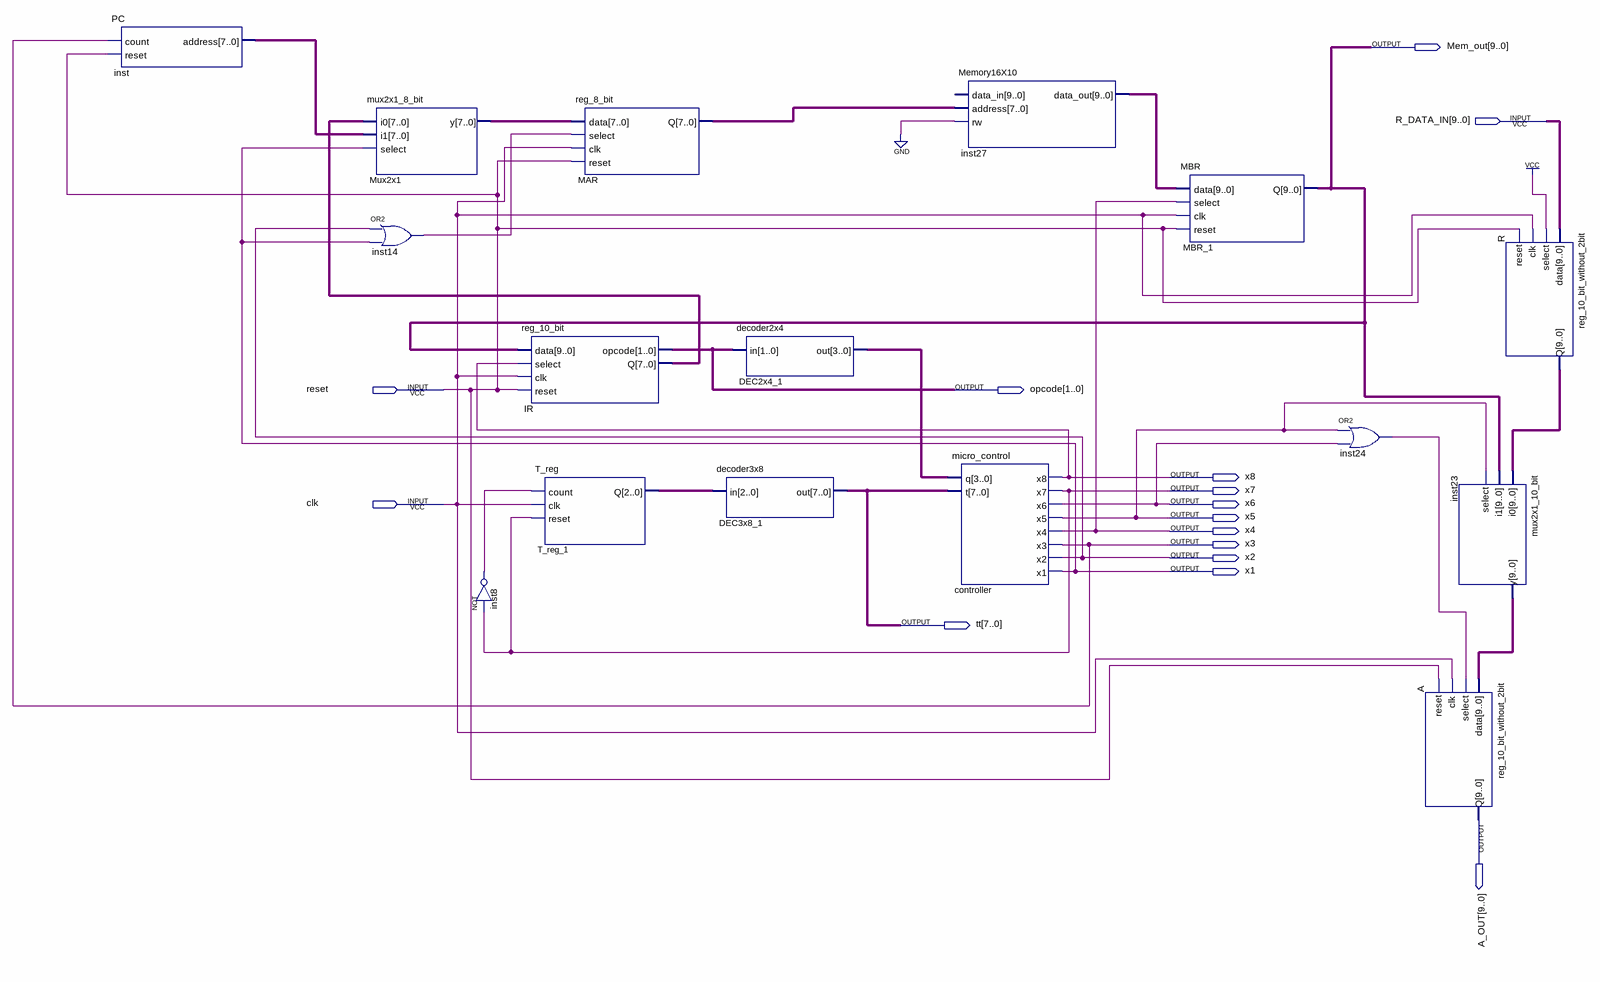
[diagram p0: schematic sheet]
// Quartus schematic orag_v2.bdf as structural Verilog: 16 symbols, 15 pins
module orag_v2 (
  input  [9:0] R_DATA_IN,
  input  reset,
  input  clk,
  output [9:0] Mem_out,
  output [1:0] opcode,
  output x8,
  output x7,
  output x6,
  output x5,
  output x4,
  output x3,
  output x2,
  output x1,
  output [7:0] tt,
  output [9:0] A_OUT
);

  wire inst8_out, inst14_out, inst24_out;
  wire [2:0] T_reg_1_q;
  wire [3:0] DEC2x4_1_out;
  wire [7:0] inst_address, IR_q, MAR_q, Mux2x1_y;
  wire [9:0] inst23_y, inst27_data_out, R_q;

  PC inst (.count(x3), .reset(reset), .address(inst_address));
  mux2x1_8_bit Mux2x1 (.i0(IR_q), .i1(inst_address), .select(x1), .y(Mux2x1_y));
  or inst14 (inst14_out, x2, x1);
  not inst8 (inst8_out, x7);
  reg_10_bit IR (.data(Mem_out), .select(x8), .clk(clk), .reset(reset), .opcode(opcode), .Q(IR_q));
  reg_8_bit MAR (.data(Mux2x1_y), .select(inst14_out), .clk(clk), .reset(reset), .Q(MAR_q));
  T_reg T_reg_1 (.count(inst8_out), .clk(clk), .reset(x7), .Q(T_reg_1_q));
  decoder2x4 DEC2x4_1 (.in(opcode), .out(DEC2x4_1_out));
  decoder3x8 DEC3x8_1 (.in(T_reg_1_q), .out(tt));
  Memory16X10 inst27 (.address(MAR_q), .rw(1'b0), .data_out(inst27_data_out));  // open: data_in
  micro_control controller (
    .q(DEC2x4_1_out), .t(tt), .x8(x8), .x7(x7), .x6(x6), .x5(x5), .x4(x4), .x3(x3), .x2(x2), .x1(x1));
  MBR MBR_1 (.data(inst27_data_out), .select(x4), .clk(clk), .reset(reset), .Q(Mem_out));
  or inst24 (inst24_out, x5, x6);
  reg_10_bit_without_2bit A (.data(inst23_y), .select(inst24_out), .clk(clk), .reset(reset), .Q(A_OUT));
  reg_10_bit_without_2bit R (.data(R_DATA_IN), .select(1'b1), .clk(clk), .reset(reset), .Q(R_q));
  mux2x1_10_bit inst23 (.i0(R_q), .i1(Mem_out), .select(x5), .y(inst23_y));
endmodule
